# Altium project HMS.Wifi.Controler.PrjPcb
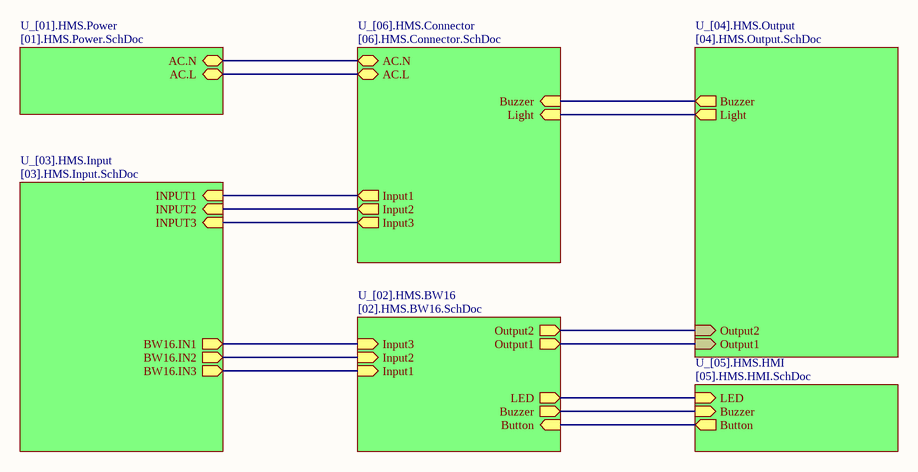
[diagram p0: [00].HMS.Wifi.Controler.SchDoc]
7 sheets, 52 parts. Net scope: hierarchical (ports join the sheet entries above them; power ports are global).
Board file: HMS.Wifi.Controler.PcbDoc
Sheets:
  [00].HMS.Wifi.Controler.SchDoc
    U_[02].HMS.BW16 = [02].HMS.BW16.SchDoc
    U_[03].HMS.Input = [03].HMS.Input.SchDoc
    U_[04].HMS.Output = [04].HMS.Output.SchDoc
    U_[05].HMS.HMI = [05].HMS.HMI.SchDoc
    U_[06].HMS.Connector = [06].HMS.Connector.SchDoc
    U_[01].HMS.Power = [01].HMS.Power.SchDoc

## Sheet [00].HMS.Wifi.Controler.SchDoc
size A4; SheetNumber: 1; SheetTotal: 7

### Sub-sheets
U_[01].HMS.Power = [01].HMS.Power.SchDoc: AC.N (bidir), AC.L (bidir)
U_[02].HMS.BW16 = [02].HMS.BW16.SchDoc: Button (in), LED (out), Output2 (out), Output1 (out), Input3 (in), Input2 (in), Buzzer (out), Input1 (in)
U_[03].HMS.Input = [03].HMS.Input.SchDoc: INPUT1 (in), BW16.IN1 (out), INPUT2 (in), BW16.IN2 (out), INPUT3 (in), BW16.IN3 (out)
U_[04].HMS.Output = [04].HMS.Output.SchDoc: Output2 (in), Buzzer (out), Output1 (in), Light (out)
U_[05].HMS.HMI = [05].HMS.HMI.SchDoc: LED (in), Button (out), Buzzer (in)
U_[06].HMS.Connector = [06].HMS.Connector.SchDoc: AC.L (bidir), AC.N (bidir), Input1 (out), Input2 (out), Input3 (out), Buzzer (in), Light (in)

### Nets
AC_L: sheet U_[06].HMS.Connector/AC.L, sheet U_[01].HMS.Power/AC.L
AC_N: sheet U_[06].HMS.Connector/AC.N, sheet U_[01].HMS.Power/AC.N
Button: sheet U_[02].HMS.BW16/Button, sheet U_[05].HMS.HMI/Button
Buzzer: sheet U_[02].HMS.BW16/Buzzer, sheet U_[05].HMS.HMI/Buzzer
LED: sheet U_[02].HMS.BW16/LED, sheet U_[05].HMS.HMI/LED
NetMD200_12: sheet U_[02].HMS.BW16/Output2, sheet U_[04].HMS.Output/Output2
NetMD200_13: sheet U_[02].HMS.BW16/Output1, sheet U_[04].HMS.Output/Output1
NetMD200_14: sheet U_[02].HMS.BW16/Input1, sheet U_[03].HMS.Input/BW16.IN3
NetMD200_15: sheet U_[02].HMS.BW16/Input2, sheet U_[03].HMS.Input/BW16.IN2
NetMD200_16: sheet U_[02].HMS.BW16/Input3, sheet U_[03].HMS.Input/BW16.IN1
NetP600_3: sheet U_[04].HMS.Output/Light, sheet U_[06].HMS.Connector/Light
NetP600_4: sheet U_[04].HMS.Output/Buzzer, sheet U_[06].HMS.Connector/Buzzer
NetP600_6: sheet U_[03].HMS.Input/INPUT3, sheet U_[06].HMS.Connector/Input3
NetP600_7: sheet U_[03].HMS.Input/INPUT2, sheet U_[06].HMS.Connector/Input2
NetP600_8: sheet U_[03].HMS.Input/INPUT1, sheet U_[06].HMS.Connector/Input1

## Sheet [02].HMS.BW16.SchDoc
size A4; SheetNumber: 3; SheetTotal: 7
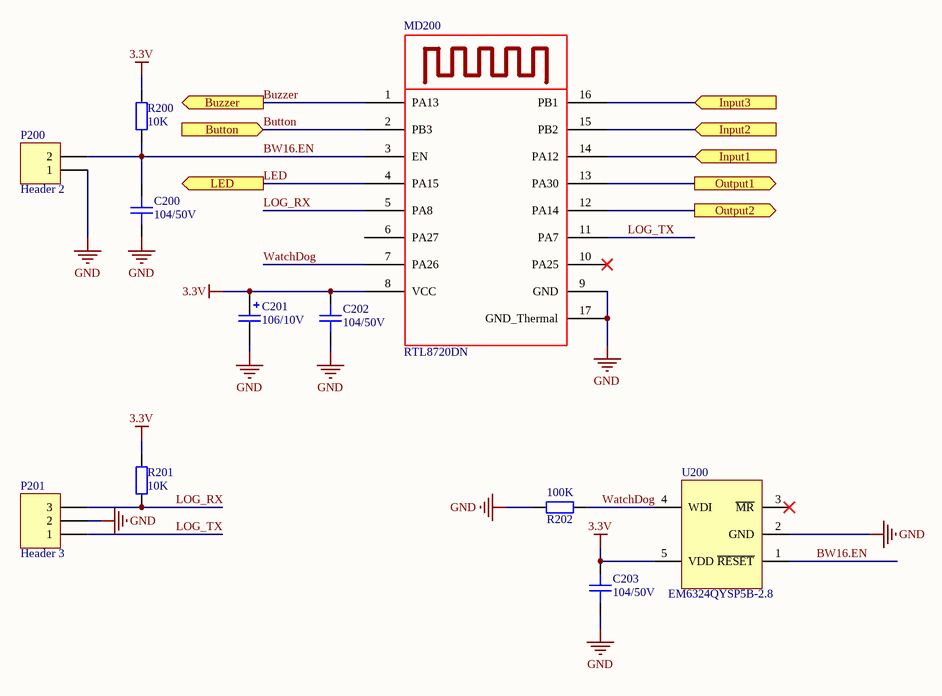
[diagram p1: [02].HMS.BW16.SchDoc]

### Parts
C200  104/50V  [CAP_CERAMIC_0402(1005)]
C201  106/10V  [CAP_TANTAL_1206(3216-18)]
C202  104/50V  [CAP_CERAMIC_0402(1005)]
C203  104/50V  [CAP_CERAMIC_0402(1005)]
MD200  RTL8720DN  [BW16]
P200  Header 2  [HDR1X2]
P201  Header 3  [HDR1X3]
R200  10K  [RES_0402(1005)]
R201  10K  [RES_0402(1005)]
R202  100K  [RES_0402(1005)]
U200  EM6324QYSP5B-2.8  [SOT23-5]

### Ports
Button (in), Buzzer (out), Input1 (in), Input2 (in), Input3 (in), LED (out), Output1 (out), Output2 (out)

### Nets
3.3V: C201.1 C202.1 C203.1 MD200.8(VCC) R200.1 R201.2 U200.5(VDD)
GND: C200.2 C201.2 C202.2 C203.2 MD200.9(GND) MD200.17(GND_Thermal) P200.1 P201.2 R202.2 U200.2(GND)
Button: MD200.2(PB3) ; port Button
Buzzer: MD200.1(PA13) ; port Buzzer
BW16.EN: C200.1 MD200.3(EN) P200.2 R200.2 U200.1(~{RESET})
LED: MD200.4(PA15) ; port LED
LOG_RX: MD200.5(PA8) P201.3 R201.1
LOG_TX: MD200.11(PA7) P201.1
WatchDog: MD200.7(PA26) R202.1 U200.4(WDI)
NetMD200_12: MD200.12(PA14) ; port Output2
NetMD200_13: MD200.13(PA30) ; port Output1
NetMD200_14: MD200.14(PA12) ; port Input1
NetMD200_15: MD200.15(PB2) ; port Input2
NetMD200_16: MD200.16(PB1) ; port Input3

Not connected (* = marked no-connect by the designer): MD200 6(PA27) 10(PA25)*; U200 3(~{MR})*

### Library data of the parts
C200 C202 C203 = CC0402KRX5R9BB104: CAP CER 0.1UF 50V X5R 0402; MFR: YAGEO; MPN: CC0402KRX5R9BB104; Category: Ceramic Capacitors; Value: 104/50V
C201 = TAJC107K010RNJ: CAP Tantal 10uF/6.3V 10% 1206; MPN: 293D106X96R3A2TE3; MFR: KYOCERA AVX Componenis; Value: 107/10V
MD200 = RTL8720DN: Module dual wifi 2.4GHz/5.8GHz + BL 5.0; MPN: RTL8720DN
P200 = Header 2: Header, 2-Pin; LatestRevisionDate: 17-Jul-2002; LatestRevisionNote: Re-released for DXP Platform.; Publisher: Altium Limited; NPN: Header 2
P201 = Header 3: Header, 3-Pin; LatestRevisionDate: 17-Jul-2002; LatestRevisionNote: Re-released for DXP Platform.; Publisher: Altium Limited; NPN: Header 3
R200 = RC0402JR-0710KL: RES 10K OHM 5% 1/8W 0402; MFR: YAGEO; Voltage Rating: 50V; Power Rating: 1/16W; MPN: RC0402JR-0710KL; Value: 10K; Category: 0402; Tolerance: 5%
R201 R202 = RC0402JR-0710KL: RES 10K OHM 5% 1/8W 0402; MFR: YAGEO; Value: NC; Voltage Rating: 50V; Power Rating: 1/16W; MPN: RC0402JR-0710KL; Category: 0402; Tolerance: 5%
U200 = EM6324QYSP5B: External watchdog reset; Value: EM6324QYSP5B-2.8

## Sheet [03].HMS.Input.SchDoc
size A4; SheetNumber: 4; SheetTotal: 7
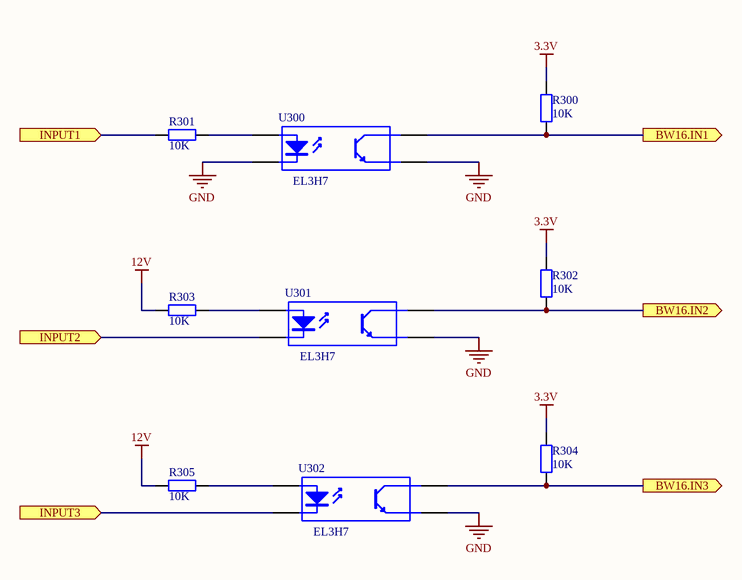
[diagram p2: [03].HMS.Input.SchDoc]

### Parts
R300  10K  [RES_0402(1005)]
R301  10K  [RES_0402(1005)]
R302  10K  [RES_0402(1005)]
R303  10K  [RES_0402(1005)]
R304  10K  [RES_0402(1005)]
R305  10K  [RES_0402(1005)]
U300  EL3H7  [Opto small]
U301  EL3H7  [Opto small]
U302  EL3H7  [Opto small]

### Ports
BW16.IN1 (out), BW16.IN2 (out), BW16.IN3 (out), INPUT1 (in), INPUT2 (in), INPUT3 (in)

### Nets
3.3V: R300.2 R302.2 R304.2
12V: R303.1 R305.1
GND: U300.2 U300.3 U301.3 U302.3
NetMD200_14: R304.1 U302.4 ; port BW16.IN3
NetMD200_15: R302.1 U301.4 ; port BW16.IN2
NetMD200_16: R300.1 U300.4 ; port BW16.IN1
NetP600_6: U302.2 ; port INPUT3
NetP600_7: U301.2 ; port INPUT2
NetP600_8: R301.1 ; port INPUT1
NetR301_2: R301.2 U300.1
NetR303_2: R303.2 U301.1
NetR305_2: R305.2 U302.1

### Library data of the parts
R300 R302 R304 = RC0402JR-074K7P: RES 10K OHM 5% 1/16W 0402; MFR: YAGEO; Category: Chip Resistor - Surface Mount; MPN: RC0402JR-074K7P; Value: 10K
R301 R303 R305 = RC0402JR-0710KL: RES 10K OHM 5% 1/16W 0402; MPN: RC0402JR-074K7P; MFR: YAGEO; Category: Chip Resistor - Surface Mount; Value: 10K
U300-U302 = Optocouplers: EL3H7 Optoisolator 3.75KV 1CH 4-SSOP; Manufacturer: Vishay Semiconductors; Manufacturer Part Number: VOM617A-2T; Input Type: DC; Isolation Voltage: 3750 Vrms; Output Device: NPN Phototransistor; Forward Current: 5 mA; Current Transfer Ratio: 63 % to 125 %; Maximum Collector Current: 100 mA; Maximum Collector Emitter Saturation Voltage: 0.4 V; Maximum Collector Emitter Voltage: 80 V; Maximum Fall Time: 12 us; Maximum Forward Diode Voltage: 1.6 V; Maximum Input Diode Current: 60 mA; Maximum Power Dissipation: 170 mW; Maximum Reverse Diode Voltage: 6 V; Maximum Rise Time: 7 us; Number of Channels per Chip: 1 Channel; Product Status: New Product; Value: Iin = 1A, Iout = 50mA; Supplier 1: Mouser; RoHS: RoHS Compliant; Category: Transistor Output Optocouplers; Stock 1: 2915; Pricing 1: 1=0.405, 10=0.365, 100=0.324, 250=0.297, 500=0.270, 1000=0.243, 3000=0.230, 6000=0.216, 12000=0.203 (AUD); Package / Case: SOP-4 Mini-Flat; Packaging: Reel; Maximum Operating Temperature: + 110 C; Minimum Operating Temperature: - 55 C; Product Category: Optocouplers; RoHS - Mouser: Y; Minimum Order Quantity: 1; Reeling: True; ComponentLink1URL: http://www.mouser.com/ds/2/427/vom617a-223478.pdf; ComponentLink1Description: http://www.mouser.com/ds/2/427/vom617a-223478.pdf; Supplier Part Number 1: 78-VOM617A-2T; MPN: EL3H7; MFR: Vishay Semiconductors

## Sheet [04].HMS.Output.SchDoc
size A4; SheetNumber: 5; SheetTotal: 7
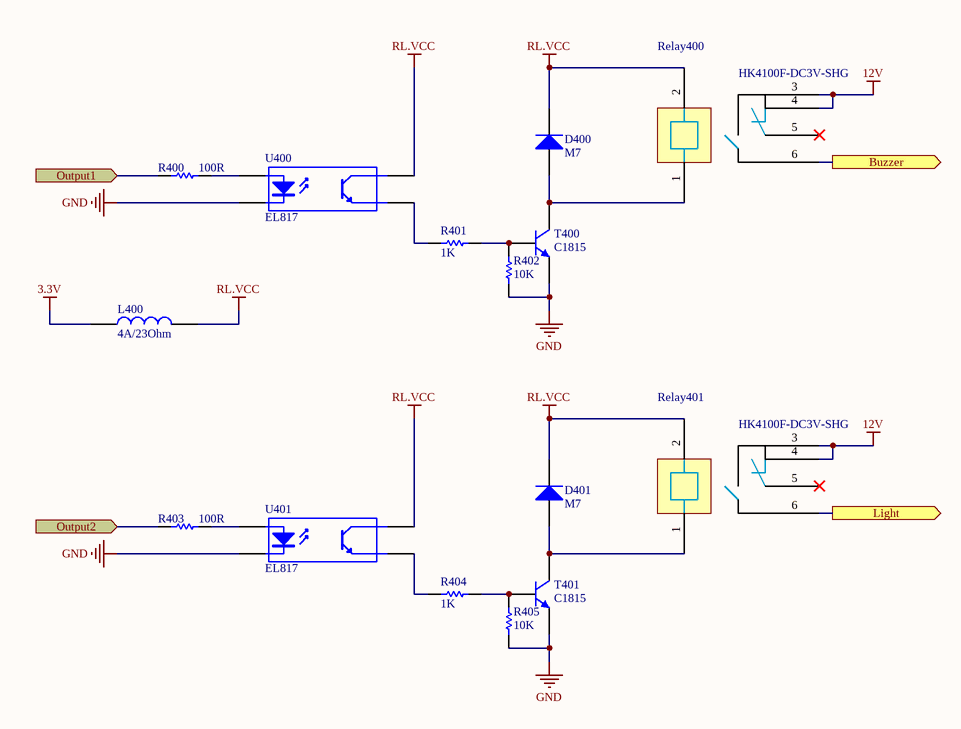
[diagram p3: [04].HMS.Output.SchDoc]

### Parts
D400  M7  [DO214AC_SMA_1808]
D401  M7  [DO214AC_SMA_1808]
L400  4A/23Ohm  [Inductor_0603]
R400  100R  [RES_0402(1005)]
R401  1K  [RES_0402(1005)]
R402  10K  [RES_0402(1005)]
R403  100R  [RES_0402(1005)]
R404  1K  [RES_0402(1005)]
R405  10K  [RES_0402(1005)]
Relay400  HK4100F-DC3V-SHG  [HK4001F]
Relay401  HK4100F-DC3V-SHG  [HK4001F]
T400  C1815  [SOT23-3]
T401  C1815  [SOT23-3]
U400  EL817  [Opto small]
U401  EL817  [Opto small]

### Ports
Buzzer (out), Light (out), Output1 (in), Output2 (in)

### Nets
3.3V: L400.1
12V: Relay400.3 Relay400.4 Relay401.3 Relay401.4
GND: R402.1 R405.1 T400.2(E) T401.2(E) U400.2 U401.2
RL.VCC: D400.2(K) D401.2(K) L400.2 Relay400.2 Relay401.2 U400.4 U401.4
NetD400_1: D400.1(A) Relay400.1 T400.3(C)
NetD401_1: D401.1(A) Relay401.1 T401.3(C)
NetMD200_12: R403.2 ; port Output2
NetMD200_13: R400.2 ; port Output1
NetP600_3: Relay401.6 ; port Light
NetP600_4: Relay400.6 ; port Buzzer
NetR400_1: R400.1 U400.1
NetR401_1: R401.1 R402.2 T400.1(B)
NetR401_2: R401.2 U400.3
NetR403_1: R403.1 U401.1
NetR404_1: R404.1 R405.2 T401.1(B)
NetR404_2: R404.2 U401.3

Not connected (* = marked no-connect by the designer): Relay400 5*; Relay401 5*

### Library data of the parts
D400 D401 = Diode M7: Diode M7 - 1N4007; MPN: 1N4007 M7; Value: 1000V 1A; Published: 8-Jun-2000; LatestRevisionDate: 17-Jul-2002; LatestRevisionNote: Re-released for DXP Platform.; DatasheetDocument: 1997; PackageReference: DO-35; Publisher: Altium Limited; Code_JEDEC: DO-204-AH; ComponentLink1Description: Manufacturer Link; ComponentLink1URL: http://www.fairchildsemi.com/; ComponentLink2Description: Datasheet; ComponentLink2URL: http://www.fairchildsemi.com/ds/1N%2F1N4448.pdf; Category: Diode
L400 = FBMJ1608HM230NT: Inductor Ferrites 4A SMD 0603; MFR: Taiyo Yuden; MPN: FBMJ1608HM230NT; Category: Ferrite Beads and Chips; Value: 4A/23Ohm
R400 R403 = Res1: RES 100 OHM 1% 1/8W 0402; MPN: RC0402FR-7W100RL; MFR: YAGEO; Value: 300R; Published: 8-Jun-2000; LatestRevisionDate: 17-Jul-2002; LatestRevisionNote: Re-released for DXP Platform.; PackageReference: AXIAL-0.3; Publisher: Altium Limited; Category: Chip Resistor - Surface Mount
R401 R404 = Res1: RES 1K OHM 1% 1/8W 0402; MPN: RC0402FR-071KL; MFR: YAGEO; Published: 8-Jun-2000; LatestRevisionDate: 17-Jul-2002; LatestRevisionNote: Re-released for DXP Platform.; PackageReference: AXIAL-0.3; Publisher: Altium Limited; Value: 1K; Category: Chip Resistor - Surface Mount
R402 R405 = Res1: RES 10K OHM 5% 1/8W 0402; MPN: RC0402JR-0710KL; MFR: YAGEO; Published: 8-Jun-2000; LatestRevisionDate: 17-Jul-2002; LatestRevisionNote: Re-released for DXP Platform.; PackageReference: AXIAL-0.3; Publisher: Altium Limited; Value: 10K; Category: Chip Resistor - Surface Mount
Relay400 Relay401 = HK4100F: HK4100F-DC3V-SHG Relay 3V 3A 6 chân; MFR: OEM; Value: 3V3DC; MPN: HK4100F-DC3V-SHG; Category: Relay
T400 T401 = 2N3904: Trans C1815 NPN 0.15A/50V SMD SOT23; MPN: 2SC1815; MFR: LinhKienChatLuong; Value: 0.15A 60V SOT-23; Published: 8-Jun-2000; LatestRevisionDate: 15-Jan-2003; LatestRevisionNote: PCB Footprint 'BCY-W3/D4.7' replaced; DatasheetVersion: 1997; PackageVersion: Sep-1998; PackageReference: TO-92A; Publisher: Altium Limited; PackageDescription: TO, Flat Index; 3 In-Line, Axial Leads; Body Dia. 4.5mm; Leads 0.51 x 0.48 mm (max); ComponentLink1Description: Manufacturer Link; ComponentLink1URL: http://www.fairchildsemi.com/; ComponentLink2Description: Datasheet; ComponentLink2URL: http://www.fairchildsemi.com/ds/2N%2F2N3904.pdf; Category: Transistor NPN
U400 U401 = OPTOISO1: Optoisolator Transistor Output 3750Vrms 1 Channel 4-SOP; MFR: Vishay Semiconductor Opto Division; Value: 60V 50mA; Component Type: IC; MPN: EL817; Category: Optoisolators - Transistor, Photovoltaic Output

## Sheet [05].HMS.HMI.SchDoc
size A4; SheetNumber: 6; SheetTotal: 7
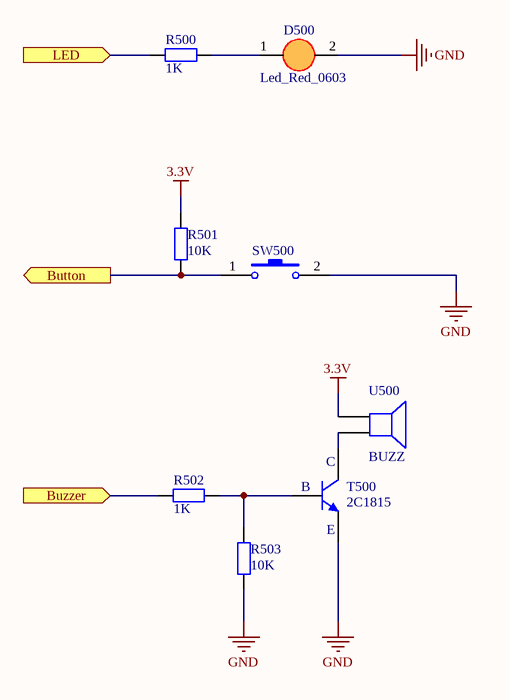
[diagram p4: [05].HMS.HMI.SchDoc]

### Parts
D500  Led_Red_0603  [LED_0603_RED]
R500  1K  [RES_0402(1005)]
R501  10K  [RES_0402(1005)]
R502  1K  [RES_0402(1005)]
R503  10K  [RES_0402(1005)]
SW500  SW-4P-S  [SW 2P 90 Dgerees]  (value not drawn)
T500  2C1815  [SOT23-3]
U500  BUZZ  [BUZZER_THROUGH_5MM]

### Ports
Button (out), Buzzer (in), LED (in)

### Nets
3.3V: R501.2 U500.1
GND: D500.2(K) R503.1 SW500.2 T500.2
Button: R501.1 SW500.1 ; port Button
Buzzer: R502.1 ; port Buzzer
LED: R500.1 ; port LED
NetD500_1: D500.1(A) R500.2
NetR502_2: R502.2 R503.2 T500.1
NetT500_3: T500.3 U500.2

### Notes on the sheet
- (in symbol C18C5) C; B; E

### Library data of the parts
D500 = LED_3MM: LED RED CLEAR CHIP SMD 0603; MFR: LinhKienChatLuong; Value: NCD0603R1; Category: LED; MPN: NCD0603R1
R500 = RC0402FR-071KL: RES 1K OHM 1% 1/8W 0402; MFR: YAGEO; Value: 1K; Category: Chip Resistor - Surface Mount; MPN: RC0402FR-071KL
R501 = RC0402FR-071KL: RES 10K OHM 5% 1/8W 0402; MPN: RC0402JR-0710KL; MFR: YAGEO; Value: 10K; Category: Chip Resistor - Surface Mount
R502 = RC0402FR-131KL: RES 1K OHM 1% 1/16W 0402; MFR: YAGEO; Value: 1K; Category: Chip Resistor - Surface Mount; MPN: RC0402FR-131KL
R503 = RC0402JR-074K7P: RES SMD 10K OHM 5% 1/16W 0402; MFR: YAGEO; ValueNC: NC; Category: Chip Resistor - Surface Mount; MPN: RC0402JR-074K7P; Value: 10K
SW500 = SW-2PIN-SMALL: Switch Small 4 Pin DIP; MPN: Button 4P 6x6x6mm nghiêng; Published: 24-Mar-1999; LatestRevisionDate: 17-Jul-2002; LatestRevisionNote: Re-released for DXP Platform.; PackageReference: SPST-2; Publisher: Altium Limited
T500 = C18C5: D882 2SD882 NPN Transistor 3A 30V SOT-89; MFR: JCET; Value: 30V - 3A; MPN: 2SD882; Category: Transistor NPN
U500 = Speaker: Buzz TMB09A03 3V 9x5.5mm; BAPartNumber: VT-0; Solder: WAVE; Published: 24-Mar-1999; LatestRevisionDate: 17-Jul-2002; LatestRevisionNote: Re-released for DXP Platform.; PackageReference: PIN2; Publisher: Altium Limited; MPN: TMB09A03; Value: BUZZ; Parameter 1: *

## Sheet [06].HMS.Connector.SchDoc
size A4; SheetNumber: 7; SheetTotal: 7
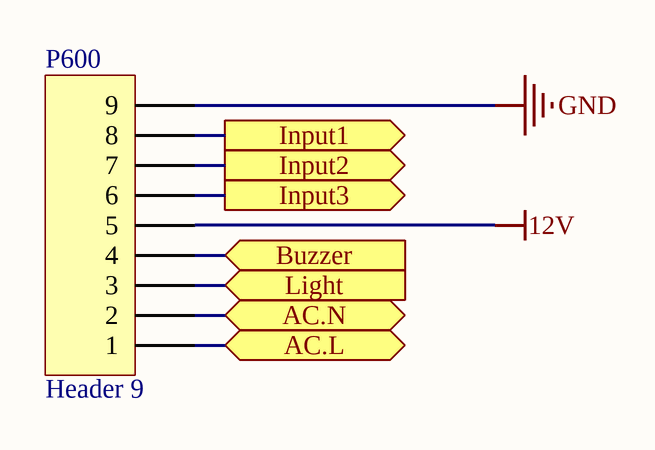
[diagram p5: [06].HMS.Connector.SchDoc]

### Parts
P600  Header 9  [KF2EDG3.5MM_9P]

### Ports
AC.L (bidir), AC.N (bidir), Buzzer (in), Input1 (out), Input2 (out), Input3 (out), Light (in)

### Nets
12V: P600.5
GND: P600.9
AC_L: P600.1 ; port AC.L
AC_N: P600.2 ; port AC.N
NetP600_3: P600.3 ; port Light
NetP600_4: P600.4 ; port Buzzer
NetP600_6: P600.6 ; port Input3
NetP600_7: P600.7 ; port Input2
NetP600_8: P600.8 ; port Input1

### Library data of the parts
P600 = Header 9: Header, 9-Pin; MPN: 15EDGRC-3.5-9P; LatestRevisionDate: 17-Jul-2002; LatestRevisionNote: Re-released for DXP Platform.; Publisher: Altium Limited

## Sheet [01].HMS.Power.SchDoc
size A4; SheetNumber: 2; SheetTotal: 7
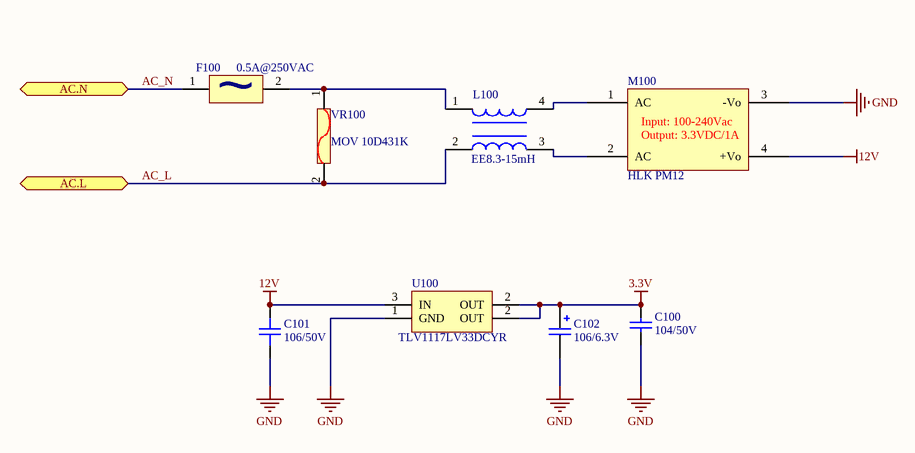
[diagram p6: [01].HMS.Power.SchDoc]

### Parts
C100  104/50V  [CAP_CERAMIC_0402(1005)]
C101  106/50V  [CAP_CERAMIC_1206(3216-18)]
C102  106/6.3V  [CAP_TANTAL_1206(3216-18)]
F100  0.5A@250VAC  [RUEF250U-2]
L100  EE8.3-15mH  [EE8.3-15mH]
M100  HLK PM12  [HLK PW03]
U100  TLV1117LV33DCYR  [LM1117-SOP]
VR100  MOV 10D431K  [MOV 10D431K]

### Ports
AC.L (bidir), AC.N (bidir)

### Nets
3.3V: C100.2 C102.1 U100.2(OUT)
12V: C101.1 M100.4(+Vo) U100.3(IN)
GND: C100.1 C101.2 C102.2 M100.3(-Vo) U100.1(GND)
AC_L: L100.2 VR100.2 ; port AC.L
AC_N: F100.1 ; port AC.N
NetF100_2: F100.2 L100.1 VR100.1
NetL100_3: L100.3 M100.2(AC)
NetL100_4: L100.4 M100.1(AC)

### Notes on the sheet
- (in symbol HLK PM03) Input: 100-240Vac; Output: 3.3VDC/1A
- (in symbol RUEF250U-2) ~

### Library data of the parts
C100 = Cap: CAP CER 0.1UF 50V X5R 0402; MPN: CC0402KRX5R9BB104; MFR: YAGEO; Published: 8-Jun-2000; LatestRevisionDate: 17-Jul-2002; LatestRevisionNote: Re-released for DXP Platform.; PackageReference: RAD-0.3; Publisher: Altium Limited; Value: 104/50V; Category: Ceramic Capacitors
C101 = CL21A106KOQNNNE: CAP Ceramic 106/16V 10% 1206; MPN: CL31A106KOHNNNE; CompanyID: VT-00018; Solder: SMT; Value: 106/50V; Category: CAPACITOR
C102 = UWT1C221MCL1GS: CAP Tantal 10uF/6.3V 10% 1206; MFR: Nichicon; MPN: 293D106X96R3A2TE3; Capacitance: 220µF; Voltage Rating: 6.3V; Tolerance: ±20%; Lifetime @ Temp.: 1000 Hrs @ 105°C; Ripple Current: 105mA; Surface Mount Land Size: 0.260" L x 0.260" W (6.60mm x 6.60mm); MP: TAJB106K006SNJ; Supplier 1: Digi-Key; RoHS: RoHS Compliant; Category: Capacitors; Stock 1: 45106; Pricing 1: 1=0.46, 10=0.366, 100=0.2205, 250=0.16536 (USD); Operating Temperature: -55°C ~ 105°C; Features: General Purpose; ESR (Equivalent Series Resistance): -; Impedance: -; Mounting Type: Surface Mount; Package / Case: Radial, Can - SMD; Size / Dimension: 0.248" Dia (6.30mm); Height - Seated (Max): 0.303" (7.70mm); Lead Spacing: -; Packaging: Cut Tape (CT); ComponentLink1URL: http://www.nichicon.co.jp/english/products/pdfs/e-wt.pdf; ComponentLink1Description: http://www.nichicon.co.jp/english/products/pdfs/e-wt.pdf; Supplier Part Number 1: 493-2179-1-ND; Value: 106/6.3V
F100 = RUEF250U-2: Cầu chì tự phục hồi 0.5A 250V; Manufacturer: Bourns; Manufacturer Part Number: MF-RX250/72-2; MPN: TRF250-500; Resistance: 0.08 Ohms; Type: PTC Resettable Fuses; Voltage Rating AC: 72 V; Current Rating (Max): 40 A; Hold Current: 2.5 A; Maximum Voltage: 72 VDC; Trip Current: 5 A; NPN: TRF250-500 DIP; Supplier 1: Mouser; RoHS: RoHS Compliant; Category: Resettable Fuses; Stock 1: 0; Pricing 1: 1=0.648, 10=0.518, 100=0.392, 250=0.352, 500=0.333, 1000=0.284, 5000=0.265, 10000=0.239 (AUD); Dimensions: 17.84 mm L x 3.1 mm W x 23.84 mm  H x 17.84 mm D; Operating Temperature Range: - 40 C to + 85 C; Packaging: Reel; Series: MF-RX/72; Termination Style: Radial; Mounting Style: Through Hole; Lead Spacing: 10.2 mm; Maximum Voltage DC: 72 V; Product Category: Radial Lead Resettable Fuses; Standard Pack Qty: 1000; RoHS - Mouser: Y; Minimum Order Quantity: 1; Reeling: True; ComponentLink1URL: http://www.bourns.com/data/global/pdfs/mfr72.pdf; ComponentLink1Description: http://www.bourns.com/data/global/pdfs/mfr72.pdf; Supplier Part Number 1: 652-MF-RX250/72-2; Value: 0.5A@250VAC
L100 = EE8.3-15mH: Cuộn lọc 15mH EE8.3; MPN: EE8.3-15mH
M100 = HLK PM03: Module Power AC Convertor DC 220VAC - 12VDC; MPN: HLKPM03
U100 = REG1117-3.3: 800mA and 1A Low Dropout Positive Regulator 3.3V; Published: 8-Jun-2000; LatestRevisionDate: 17-Jul-2002; LatestRevisionNote: Re-released for DXP Platform.; DatasheetVersion: Sep-1997; PackageVersion: revC; PackageReference: ZZ311; Publisher: Altium Limited; PackageDescription: SOT-223/SC-73; 4 Leads; Body 6.7 x 7.3 mm, inc. leads (LxW max); ComponentLink1Description: Manufacturer Link; ComponentLink1URL: http://www.ti.com/; ComponentLink2Description: Datasheet; ComponentLink2URL: http://www-s.ti.com/sc/ds/REG1117.pdf; Value: TLV1117LV33DCYR; MPN: TLV1117LV33DCYR
VR100 = Varistor 10D431K: Varistor 10D431K 430V 10mm; MPN: 10D431K

## Nets that join several sheets
3.3V: [02].HMS.BW16 (7 pins), [03].HMS.Input (R300.2 R302.2 R304.2), [04].HMS.Output (L400.1), [05].HMS.HMI (R501.2 U500.1), [01].HMS.Power (C100.2 C102.1 U100.2)
12V: [03].HMS.Input (R303.1 R305.1), [04].HMS.Output (Relay400.3 Relay400.4 Relay401.3 Relay401.4), [06].HMS.Connector (P600.5), [01].HMS.Power (C101.1 M100.4 U100.3)
GND: [02].HMS.BW16 (10 pins), [03].HMS.Input (U300.2 U300.3 U301.3 U302.3), [04].HMS.Output (6 pins), [05].HMS.HMI (D500.2 R503.1 SW500.2 T500.2), [06].HMS.Connector (P600.9), [01].HMS.Power (5 pins)
AC_L: [06].HMS.Connector (P600.1), [01].HMS.Power (L100.2 VR100.2)
AC_N: [06].HMS.Connector (P600.2), [01].HMS.Power (F100.1)
Button: [02].HMS.BW16 (MD200.2), [05].HMS.HMI (R501.1 SW500.1)
Buzzer: [02].HMS.BW16 (MD200.1), [05].HMS.HMI (R502.1)
LED: [02].HMS.BW16 (MD200.4), [05].HMS.HMI (R500.1)
NetMD200_12: [02].HMS.BW16 (MD200.12), [04].HMS.Output (R403.2)
NetMD200_13: [02].HMS.BW16 (MD200.13), [04].HMS.Output (R400.2)
NetMD200_14: [02].HMS.BW16 (MD200.14), [03].HMS.Input (R304.1 U302.4)
NetMD200_15: [02].HMS.BW16 (MD200.15), [03].HMS.Input (R302.1 U301.4)
NetMD200_16: [02].HMS.BW16 (MD200.16), [03].HMS.Input (R300.1 U300.4)
NetP600_3: [04].HMS.Output (Relay401.6), [06].HMS.Connector (P600.3)
NetP600_4: [04].HMS.Output (Relay400.6), [06].HMS.Connector (P600.4)
NetP600_6: [03].HMS.Input (U302.2), [06].HMS.Connector (P600.6)
NetP600_7: [03].HMS.Input (U301.2), [06].HMS.Connector (P600.7)
NetP600_8: [03].HMS.Input (R301.1), [06].HMS.Connector (P600.8)